# EasyEDA schematic 1-Schematic_Canokey-NFC-C.json
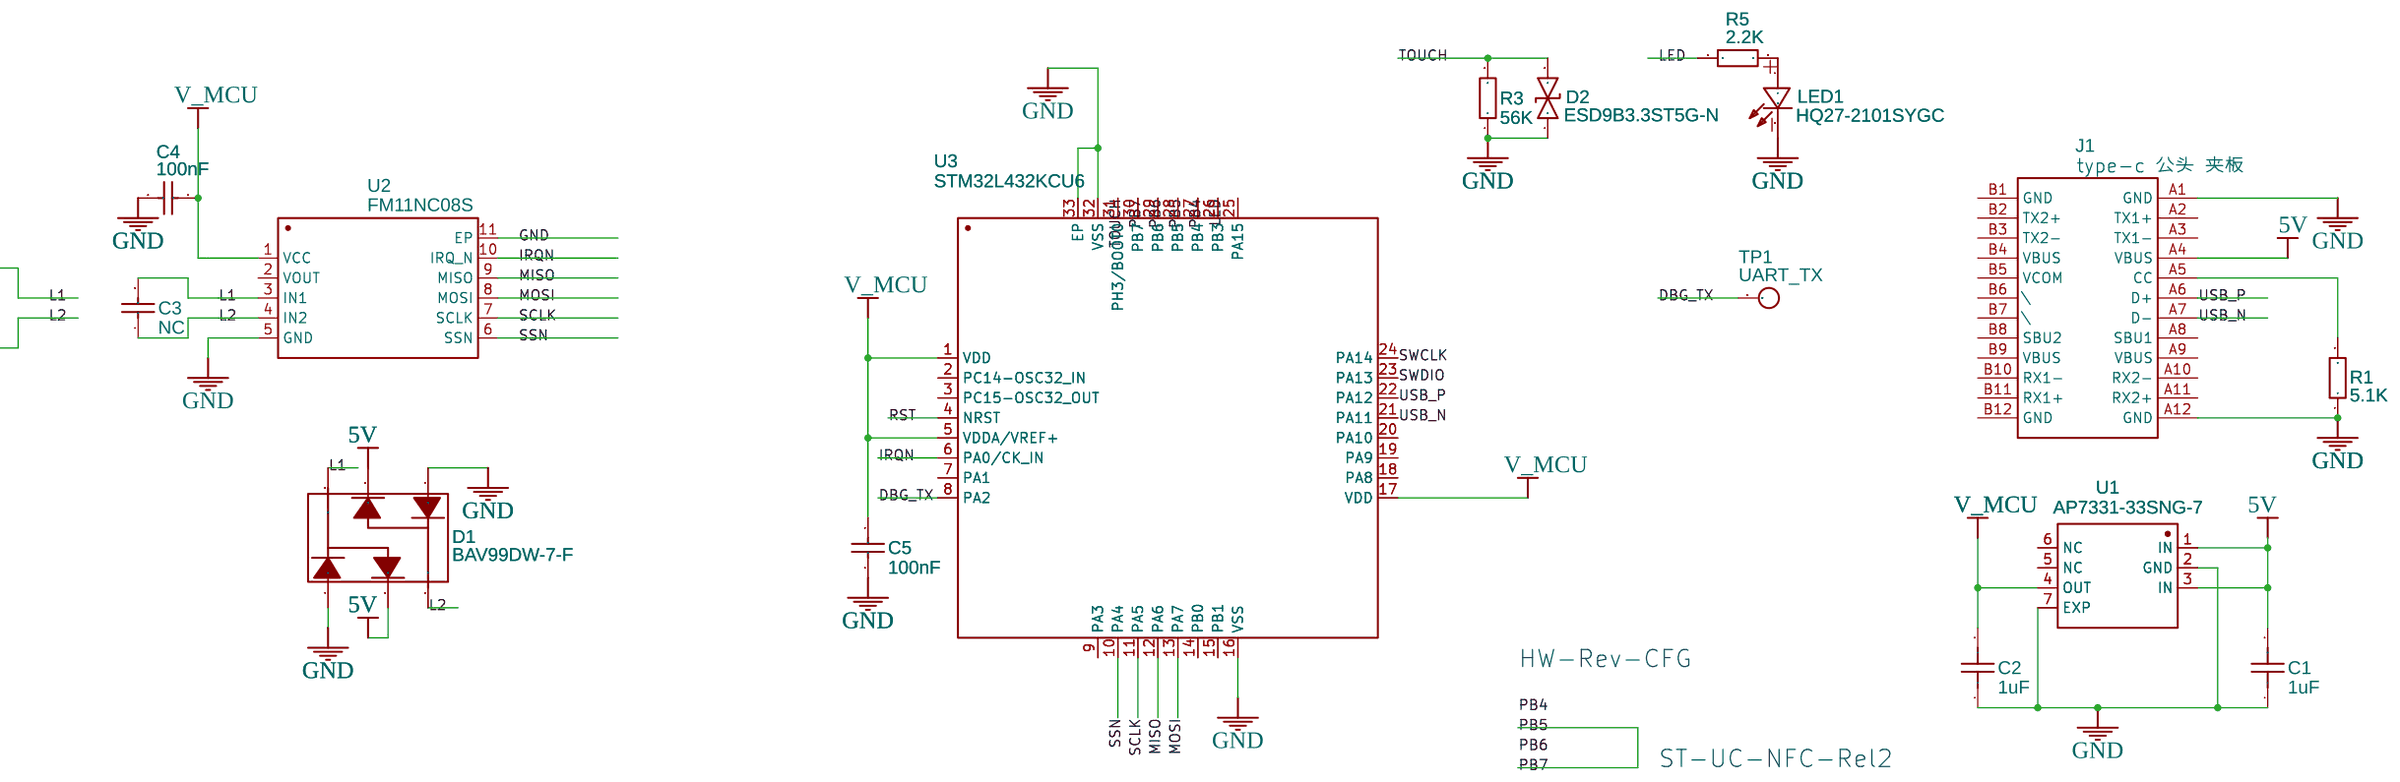
[diagram p0: schematic sheet]

## Parts
C1  1uF  [C0402]
C2  1uF  [C0402]
C3  NC  [C0402]
C4  100nF  [C0402]
C5  100nF  [0402]
D1  BAV99DW-7-F  [SC-70-6_L2.2-W1.3-P0.65-LS2.1-BL]
D2  ESD9B3.3ST5G-N  [DFN1006-2L-BI]
J1  type-c 公头 夹板  [TYPE-C 公头 夹板]
LED1  HQ27-2101SYGC  [LED-L1.7-W0.6-R]
R1  5.1K  [R0402]
R3  56K  [0402]
R5  2.2K  [0402]
TP1  UART_TX  [PAD.03X.05]
U1  AP7331-33SNG-7  [WSON-6_L2.0-W2.0-P0.65-BL-EP]
U2  FM11NC08S  [DFN-10-EP_3X3XP0.5MM]
U3  STM32L432KCU6  [UFQFPN-32_L5.0-W5.0-P0.50-BL-EP]

## Library data of the parts
C1 C2 = CL05A105KA5NQNC: Supplier: LCSC; Manufacturer: SAMSUNG; LCSC Assembly: Yes; Supplier Part: C52923; SMT Type: Basic
C3 = 0402CG560J500NT: Supplier: LCSC; Manufacturer: FH; LCSC Assembly: Yes; Supplier Part: C1572; SMT Type: Basic
C4 C5 = CL05B104KO5NNNC: Supplier: LCSC; Manufacturer: SAMSUNG; LCSC Assembly: Yes; Supplier Part: C1525; SMT Type: Basic
D1 = BAV99DW-7-F: Supplier: LCSC; Supplier Part: C150465; Manufacturer: Diodes Incorporated; Contributor: LCSC; LCSC Assembly: Yes; SMT Type: Extend
D2 = ESD9B3.3ST5G-N: Supplier: LCSC; Supplier Part: C316039; Manufacturer: Bourne Semicon (Shenzhen); Contributor: LCSC
J1 = type-c 公头 夹板: Contributor: xbz546
LED1 = HQ27-2101SYGC: Supplier: LCSC; Supplier Part: C258853; Manufacturer: Harvatek Optoelectronics (Shenzhen); Contributor: LCSC
R1 = 0402WGF5101TCE: Supplier: LCSC; Manufacturer: UniOhm; LCSC Assembly: Yes; Supplier Part: C25905; SMT Type: Basic
R3 = 0402WGF5602TCE: Supplier: LCSC; Manufacturer: UniOhm; LCSC Assembly: Yes; Supplier Part: C25796; SMT Type: Basic
R5 = 0402WGF2201TCE: Supplier: LCSC; Manufacturer: UniOhm; LCSC Assembly: Yes; Supplier Part: C25879; SMT Type: Basic
TP1 = -: Contributor: 89226g
U1 = AP7331-33SNG-7: Supplier: LCSC; Manufacturer: DIODES; Contributor: LCSC; Supplier Part: C150446
U2 = -: Supplier: LCSC; Supplier Part: C182885; Manufacturer: Shanghai Fudan Microelectronics; Contributor: LCSC
U3 = -: Supplier Part: C94784; Supplier: LCSC; Manufacturer: STMicroelectronics; Manufacturer Part: STM32L432KBU6

## Nets
5V: C1.2 D1.2 D1.5 J1.A4(VBUS) U1.1(IN) U1.3(IN)
GND: C1.1 C2.1 C4.2 C5.1 D1.1 D1.4 D2.1 J1.A1(GND) J1.A12(GND) LED1.2 R1.1 R3.1 U1.2(GND) U1.7(EXP) U2.5(GND) U2.11(EP) U3.16(VSS) U3.32(VSS) U3.33(EP)
DBG_TX: TP1.P$1 U3.8(PA2)
IRQN: U2.10(IRQ_N) U3.6(PA0/CK_IN)
L1: C3.1 C3.2 D1.3 D1.6 U2.3(IN1) U2.4(IN2)
LED: R5.1 U3.26(PB3)
MISO: U2.9(MISO) U3.12(PA6)
MOSI: U2.8(MOSI) U3.13(PA7)
PB4: U3.27(PB4)
PB5: U3.28(PB5) U3.30(PB7)
PB6: U3.29(PB6)
RST: U3.4(NRST)
SCLK: U2.7(SCLK) U3.11(PA5)
SSN: U2.6(SSN) U3.10(PA4)
SWCLK: U3.24(PA14)
SWDIO: U3.23(PA13)
TOUCH: D2.2 R3.2 U3.31(PH3/BOOT0)
USB_N: J1.A7(D-) U3.21(PA11)
USB_P: J1.A6(D+) U3.22(PA12)
V_MCU: C2.2 C4.1 C5.2 U1.4(OUT) U2.1(VCC) U3.1(VDD) U3.5(VDDA/VREF+) U3.17(VDD)
Net-(J1-A5): J1.A5(CC) R1.2
Net-(LED1-1): LED1.1 R5.2

Not connected (* = marked no-connect by the designer): J1 A2(TX1+) A3(TX1-) A8(SBU1) A9(VBUS) A10(RX2-) A11(RX2+) B1(GND) B2(TX2+) B3(TX2-) B4(VBUS) B5(VCOM) B6(\) B7(\) B8(SBU2) B9(VBUS) B10(RX1-) B11(RX1+) B12(GND); U1 5(NC) 6(NC); U2 2(VOUT); U3 2(PC14-OSC32_IN) 3(PC15-OSC32_OUT) 7(PA1) 9(PA3) 14(PB0) 15(PB1) 18(PA8) 19(PA9) 20(PA10) 25(PA15)

## Notes on the sheet
- HW-Rev-CFG
- ST-UC-NFC-Rel2
